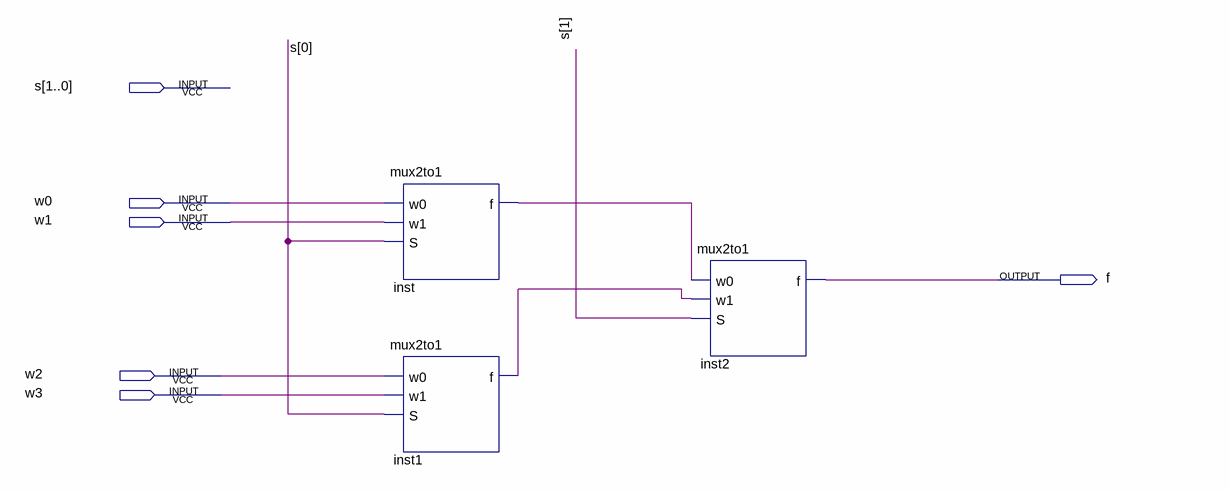
[diagram p0: schematic sheet]
// Quartus schematic muxModified (4-to-1 Multiplexer).bdf as structural Verilog: 3 symbols, 6 pins
module \muxModified_(4-to-1_Multiplexer)  (
  input  [1:0] s,
  input  w0,
  input  w1,
  input  w2,
  input  w3,
  output f
);

  wire inst1_f, inst_f;

  mux2to1 inst (.w0(w0), .w1(w1), .S(s[0]), .f(inst_f));
  mux2to1 inst1 (.w0(w2), .w1(w3), .S(s[0]), .f(inst1_f));
  mux2to1 inst2 (.w0(inst_f), .w1(inst1_f), .S(s[1]), .f(f));
endmodule
